# Altium schematic sheet main.SchDoc
size 292 x 204 mm; ProjectSection: Set ProjectSection in Document Parameters; PageSetup: Record=PageOptions|CenterHorizontal=True|CenterVertical=True|PrintScale=1.00|XCorrection=1.00|YCorrection=1.00|PrintKind=1|BorderSize=5000000|LeftOffset=0|BottomOffset=0|Orientation=2|PaperLength=1000|PaperWidth=1000|Scale=100|PaperSource=7|PrintQuality=1200|MediaType=1|DitherType=10|PaperKind=A4|PrintScaleMode=1
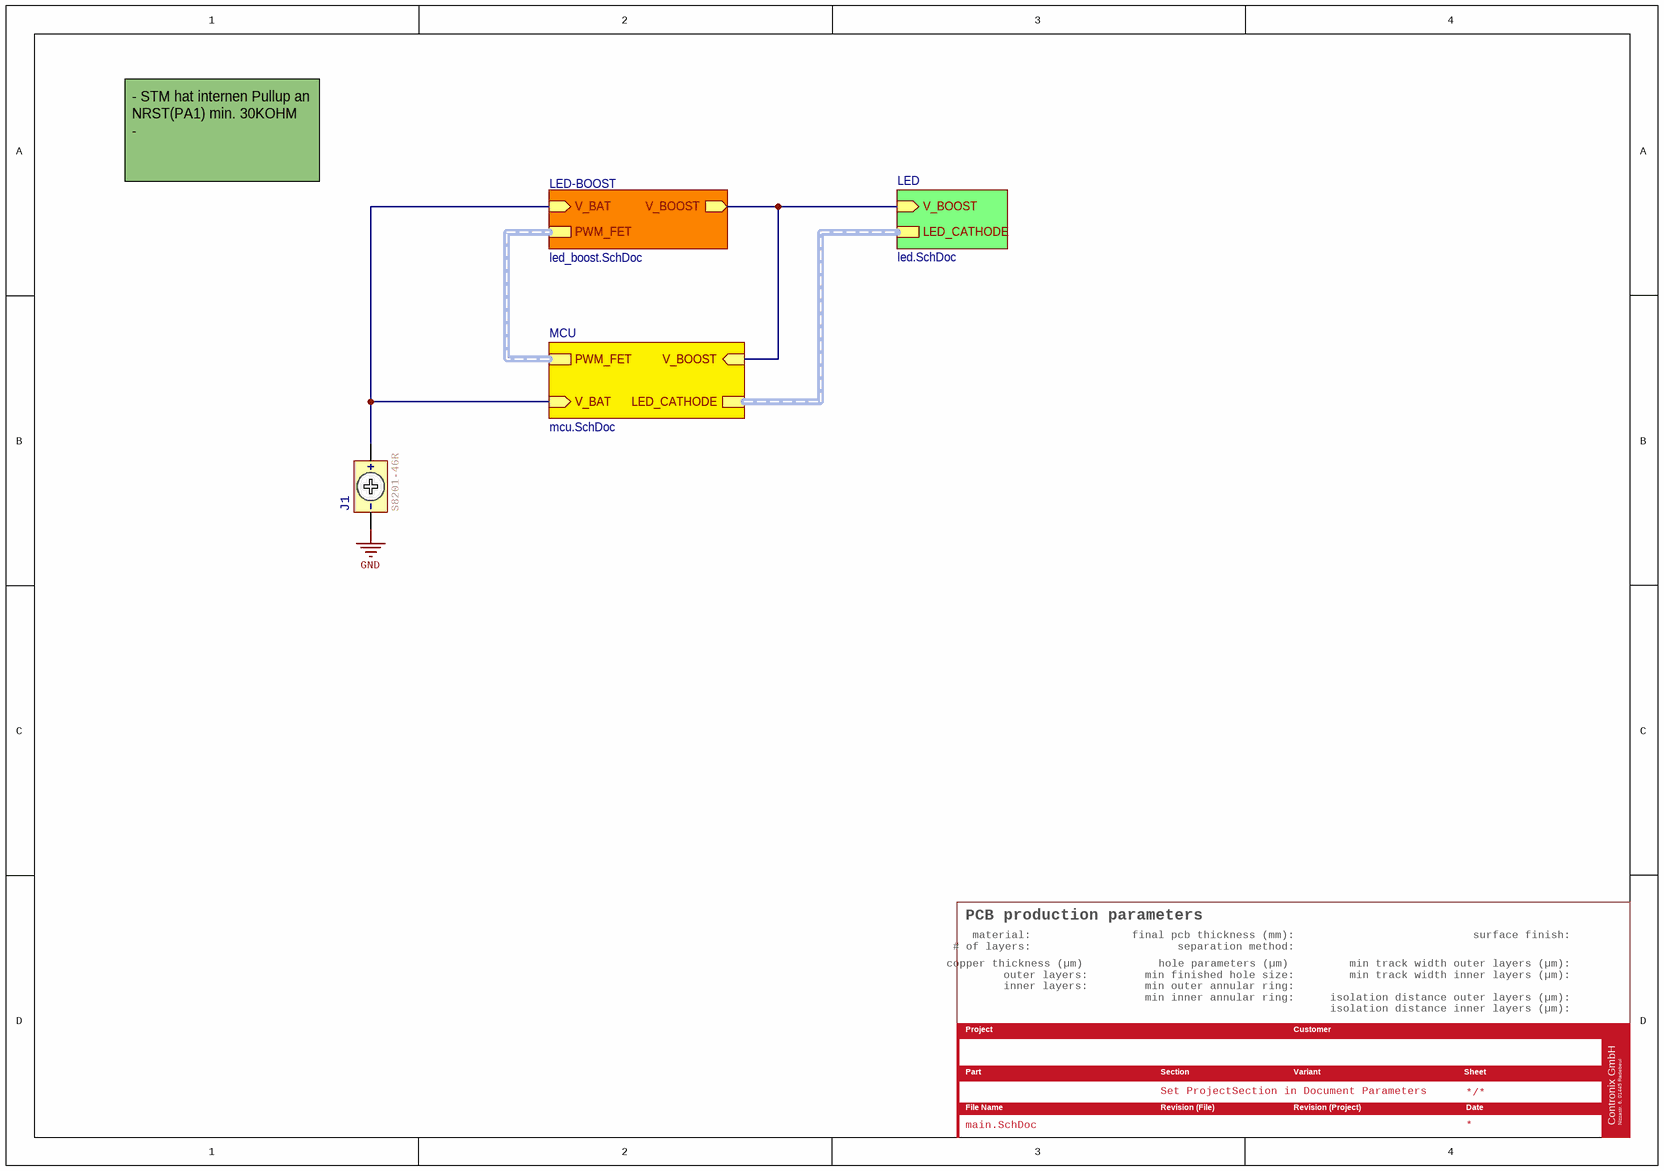
[diagram p0: main.SchDoc]

## Parts
J1  Manufacturer P/N: S8201-46R  [BAT-CR1225-SMD-HARWIN]  (hidden comment: BAT-COIN)

## Sub-sheets
LED = led.SchDoc: V_BOOST (in), LED_CATHODE (harness LED_CATHODE)
LED-BOOST = led_boost.SchDoc: PWM_FET (harness PWM_FET), V_BAT (in), V_BOOST (out)
MCU = mcu.SchDoc: V_BAT (in), LED_CATHODE (harness LED_CATHODE), PWM_FET (harness PWM_FET), V_BOOST (in)

## Nets
GND: J1.2(-)
NetJ1_1: J1.1(+) ; sheet MCU/V_BAT, sheet LED-BOOST/V_BAT
(unnamed): sheet MCU/V_BOOST, sheet LED/V_BOOST, sheet LED-BOOST/V_BOOST

## Buses and harness runs
harness sheet LED-BOOST/PWM_FET = sheet MCU/PWM_FET
harness sheet LED/LED_CATHODE = sheet MCU/LED_CATHODE

## Notes on the sheet
- - STM hat internen Pullup an NRST(PA1) min. 30KOHM
  -
- PCB production parameters
- # of layers:
- material:
- copper thickness (µm)
- outer layers:
- hole parameters (µm)
- final pcb thickness (mm):
- min finished hole size:
- separation method:
- surface finish:
- min track width outer layers (µm):
- min track width inner layers (µm):
- Project
- inner layers:
- Customer
- min outer annular ring:
- min inner annular ring:
- isolation distance outer layers (µm):
- isolation distance inner layers (µm):
- File Name
- Part
- Section
- Revision (File)
- Variant
- Revision (Project)
- Date
- Sheet
- Contronix GmbH
- Nizzastr. 6, 01445 Radebeul

## Library data of the parts
J1 = BAT-CR1225-SMD-HARWIN: CR1216 1225 Battery Holder SMT; Manufacturer: Harwin; hasAltManufacturer: 0; Contronix P/N: JWVM9H; NumberOfPins: 2; NumberOfRows: 1; Rev: =VersionControl_RevNumber; Design Item Id: BAT-CR1225-SMD-HARWIN; Price: 0,57; Price (€): 0,57; ComponentLink1Description: Manufacturer Drawing; ComponentLink1URL: https://cdn.harwin.com/pdfs/S8201R.pdf; Supplier 1: Digi-Key; Supplier Part Number 1: 952-1662-1-ND; Supplier 2: Mouser; Supplier Part Number 2: 855-S8201-46R; Created: 21.09.2020 18:54:32; Modified: 21.09.2020 18:54:32; Obsolete: 0; Type: Battery Holder; MountingType: SMT; Manufacturer Part Number: S8201-46R